# Altium schematic sheet RTC.SchDoc: RTC
size A3; DocumentNumber: 8; Revision: V2.0; SheetNumber: 8; SheetTotal: 16
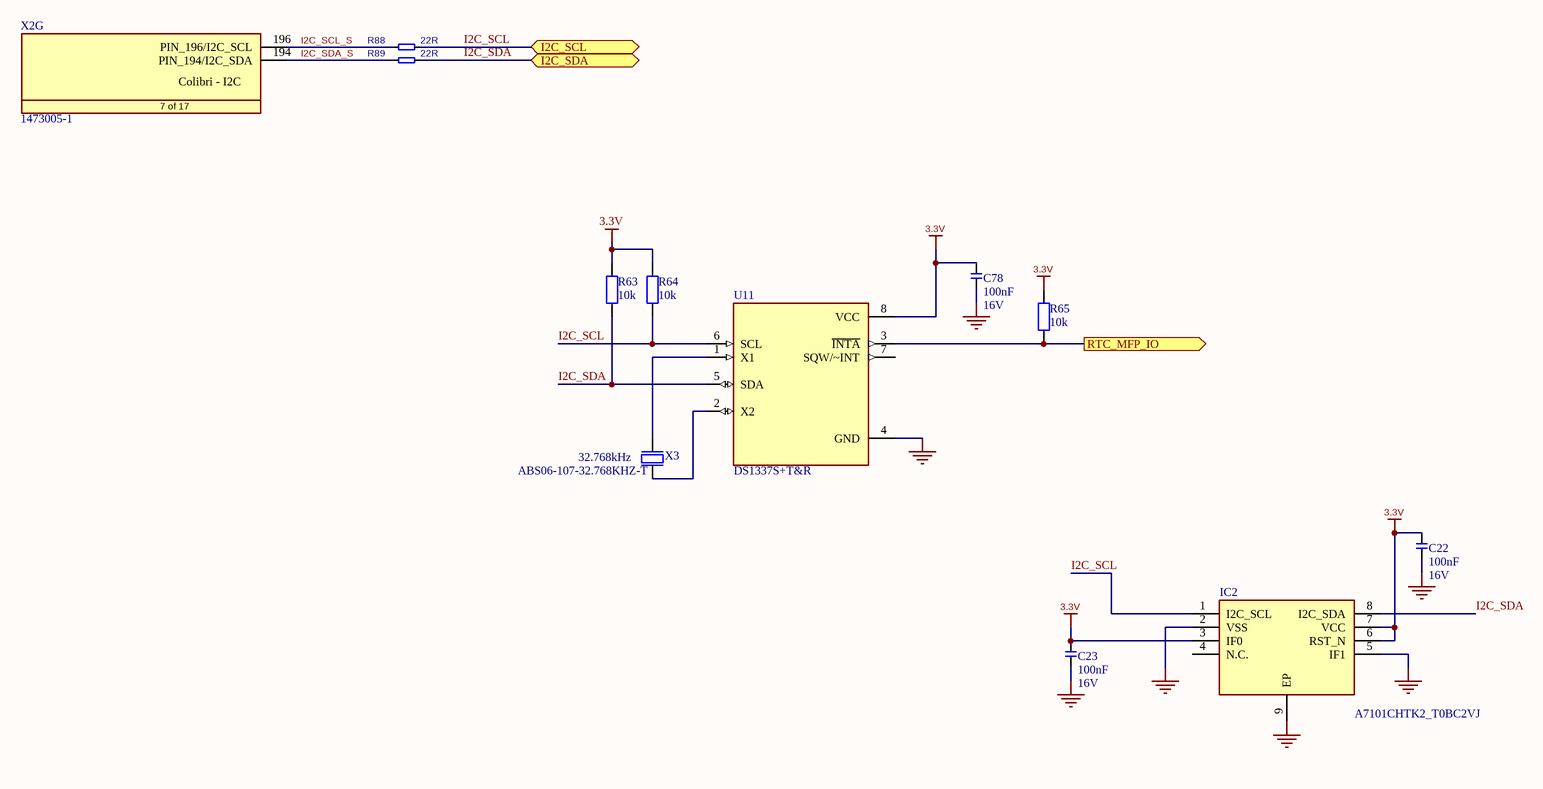
[diagram p0: RTC.SchDoc]

## Parts
C22  Rating: 16V  [T_CAPC0603X33N]  (hidden comment: 100nF)
C23  Rating: 16V  [T_CAPC0603X33N]  (hidden comment: 100nF)
C78  Rating: 16V  [T_CAPC0603X33N]  (hidden comment: 100nF)
IC2  A7101CHTK2_T0BC2VJ  [SON80P400X400X100-9N-D]
R63  10k  [RESC1608X50N]
R64  10k  [RESC1608X50N]
R65  10k  [RESC1608X50N]
R88  22R  [RESC1005X40N]
R89  22R  [RESC1005X40N]
U11  DS1337S+T&R  [SOIC127P600X175-8N]
X2  1473005-1  [T_Tyco_1473005-1]  (part G of 17)
X3  32.768kHz  Manufacturer PN: ABS06-107-32.768KHZ-T  [ABS06]

## Ports
I2C_SCL (bidir), I2C_SDA (bidir), RTC_MFP_IO (out)

## Nets
3.3V: C22.2 C23.2 C78.2 IC2.3(IF0) IC2.6(RST_N) IC2.7(VCC) R63.2 R64.2 R65.2 U11.8(VCC)
GND: C22.1 C23.1 C78.1 IC2.2(VSS) IC2.5(IF1) IC2.9(EP) U11.4(GND)
I2C_SCL: IC2.1(I2C_SCL) R64.1 R88.2 U11.6(SCL) ; port I2C_SCL
I2C_SCL_S: R88.1 X2.196(PIN_196/I2C_SCL)
I2C_SDA: IC2.8(I2C_SDA) R63.1 R89.2 U11.5(SDA) ; port I2C_SDA
I2C_SDA_S: R89.1 X2.194(PIN_194/I2C_SDA)
RTC_MFP_IO: R65.1 U11.3(~{INTA}) ; port RTC_MFP_IO
NetU11_1: U11.1(X1) X3.1(inp)
NetU11_2: U11.2(X2) X3.2(out)

Not connected (* = marked no-connect by the designer): IC2 4(N.C.); U11 7(SQW/~INT)

## Notes on the sheet
- Title
- Size:
- Date:
- A3
- Number:
- Time:
- Revision:
- Sheet
- of
- File:
- (in symbol CON-Tyco-1473005-1-200-0.6mm, part G) Colibri - I2C; 7 of 17

## Library data of the parts
C22 C23 C78 = C-X7R-100nF-16V-10%-0603: Capacitor Ceramic X7R 100nF 16V 10% 0603; Tolerance: 10%; Type: X7R; Value: 100nF
IC2 = A7101CHTK2_T0BC2VJ: Integrated Circuit; Manufacturer_Name: NXP; Manufacturer_Part_Number: A7101CHTK2/T0BC2VJ; Datasheet Link: https://componentsearchengine.com//A7101CHTK2_T0BC2VJ.pdf; Height: 1mm; Mouser2 Part Number: 771-A7101CHTKT0BC2VJ; Mouser2 Price/Stock: https://www.mouser.com/Search/Refine.aspx?Keyword=771-A7101CHTKT0BC2VJ
R63-R65 = CMP-1909346-3: RES SMD 10K OHM 1% 1/8W 0805; Voltage Rating (DC): 150.0 V; Power Rating: 0.125 W; Lead-Free Status: Contains Lead; Resistance: 10000.0 ╬®; Resistance Tolerance: ┬▒1%; Temperature Coefficient: 100.0 ppm/┬░C; Case/Package (SI): 2012; RoHS: Non-Compliant; Case/Package: 0805; Size-Width: 0.00125 m; Power Dissipation: 0.125 W; REACH SVHC Compliance: No SVHC; Size-Length: 0.002 m; Size-Height: 0.00045 m; Mounting Style: Surface Mount; Number of Pins: 2; Octopart Url: http://octopart.com/crcw080510k0fkta-vishay-46587010; OctopartID: 1d05d6c9e4e1c2c2
R88 R89 = R-22R-63mW-5%-0402: Resistor 22 ohm 63mW 5% 0402; Rating: 63mW; Tolerance: 5%; Value: 22R
U11 = DS1337S+T&R: Real Time Clock (RTC) IC Clock/Calendar IÂ²C, 2-Wire Serial 8-SOIC (0.154, 3.90mm Width); MP: DS1337S+T&amp;R; MF: Maxim Integrated; Value: *; Package: SOIC-8 Maxim; Purchase-URL: https://pricing.snapeda.com/search/part/DS1337S+T&amp;R/?ref=eda; SnapEDA_Link: https://www.snapeda.com/parts/DS1337S+T&R/Maxim%20Integrated/view-part/386900/?ref=snap; Digi-Key_Part_Number: DS1337S+T&RCT-ND; Check_prices: https://www.snapeda.com/parts/DS1337S+T&R/Maxim%20Integrated/view-part/386900/?ref=eda
X2 = CON-Tyco-1473005-1-200-0.6mm: SODIMM Connector; Manufacturer Name: Tyco; No. of ways: 200; Manufacturer Part No.: 1473005-1
X3 = XTAL_SMD2016_32MHz_8pF_Epson: XTAL SMD 2016, 32MHz, Cl=8pF, Tol: ±10ppm, Stab: ±10ppm; Part Number: XTAL_SMD2016_32MHz_12pF; Manufacturer: AVX Corp/Kyocera Corp; Note: XTAL SMD 32.000MHz; Artikkelnr Noca: 22019238; Artikkelnr Simpro: N.A.; Datasheet: http://www.epsondevice.com/docs/qd/en/DownloadServlet?id=ID000449; LatestRevisionDate: 2014-11-27; Pin Count: 4; Publisher: Nordic Semiconductor; Published: 2012-03-09; Value: 32.768kHz; Supplier: Farnell; Supplier part number: 171-2806; 2nd source Supplier: *; 2nd source part number: *; Footprint Doc: XTAL_1612